# EAGLE design 00A-94 (EAGLE 6.3)
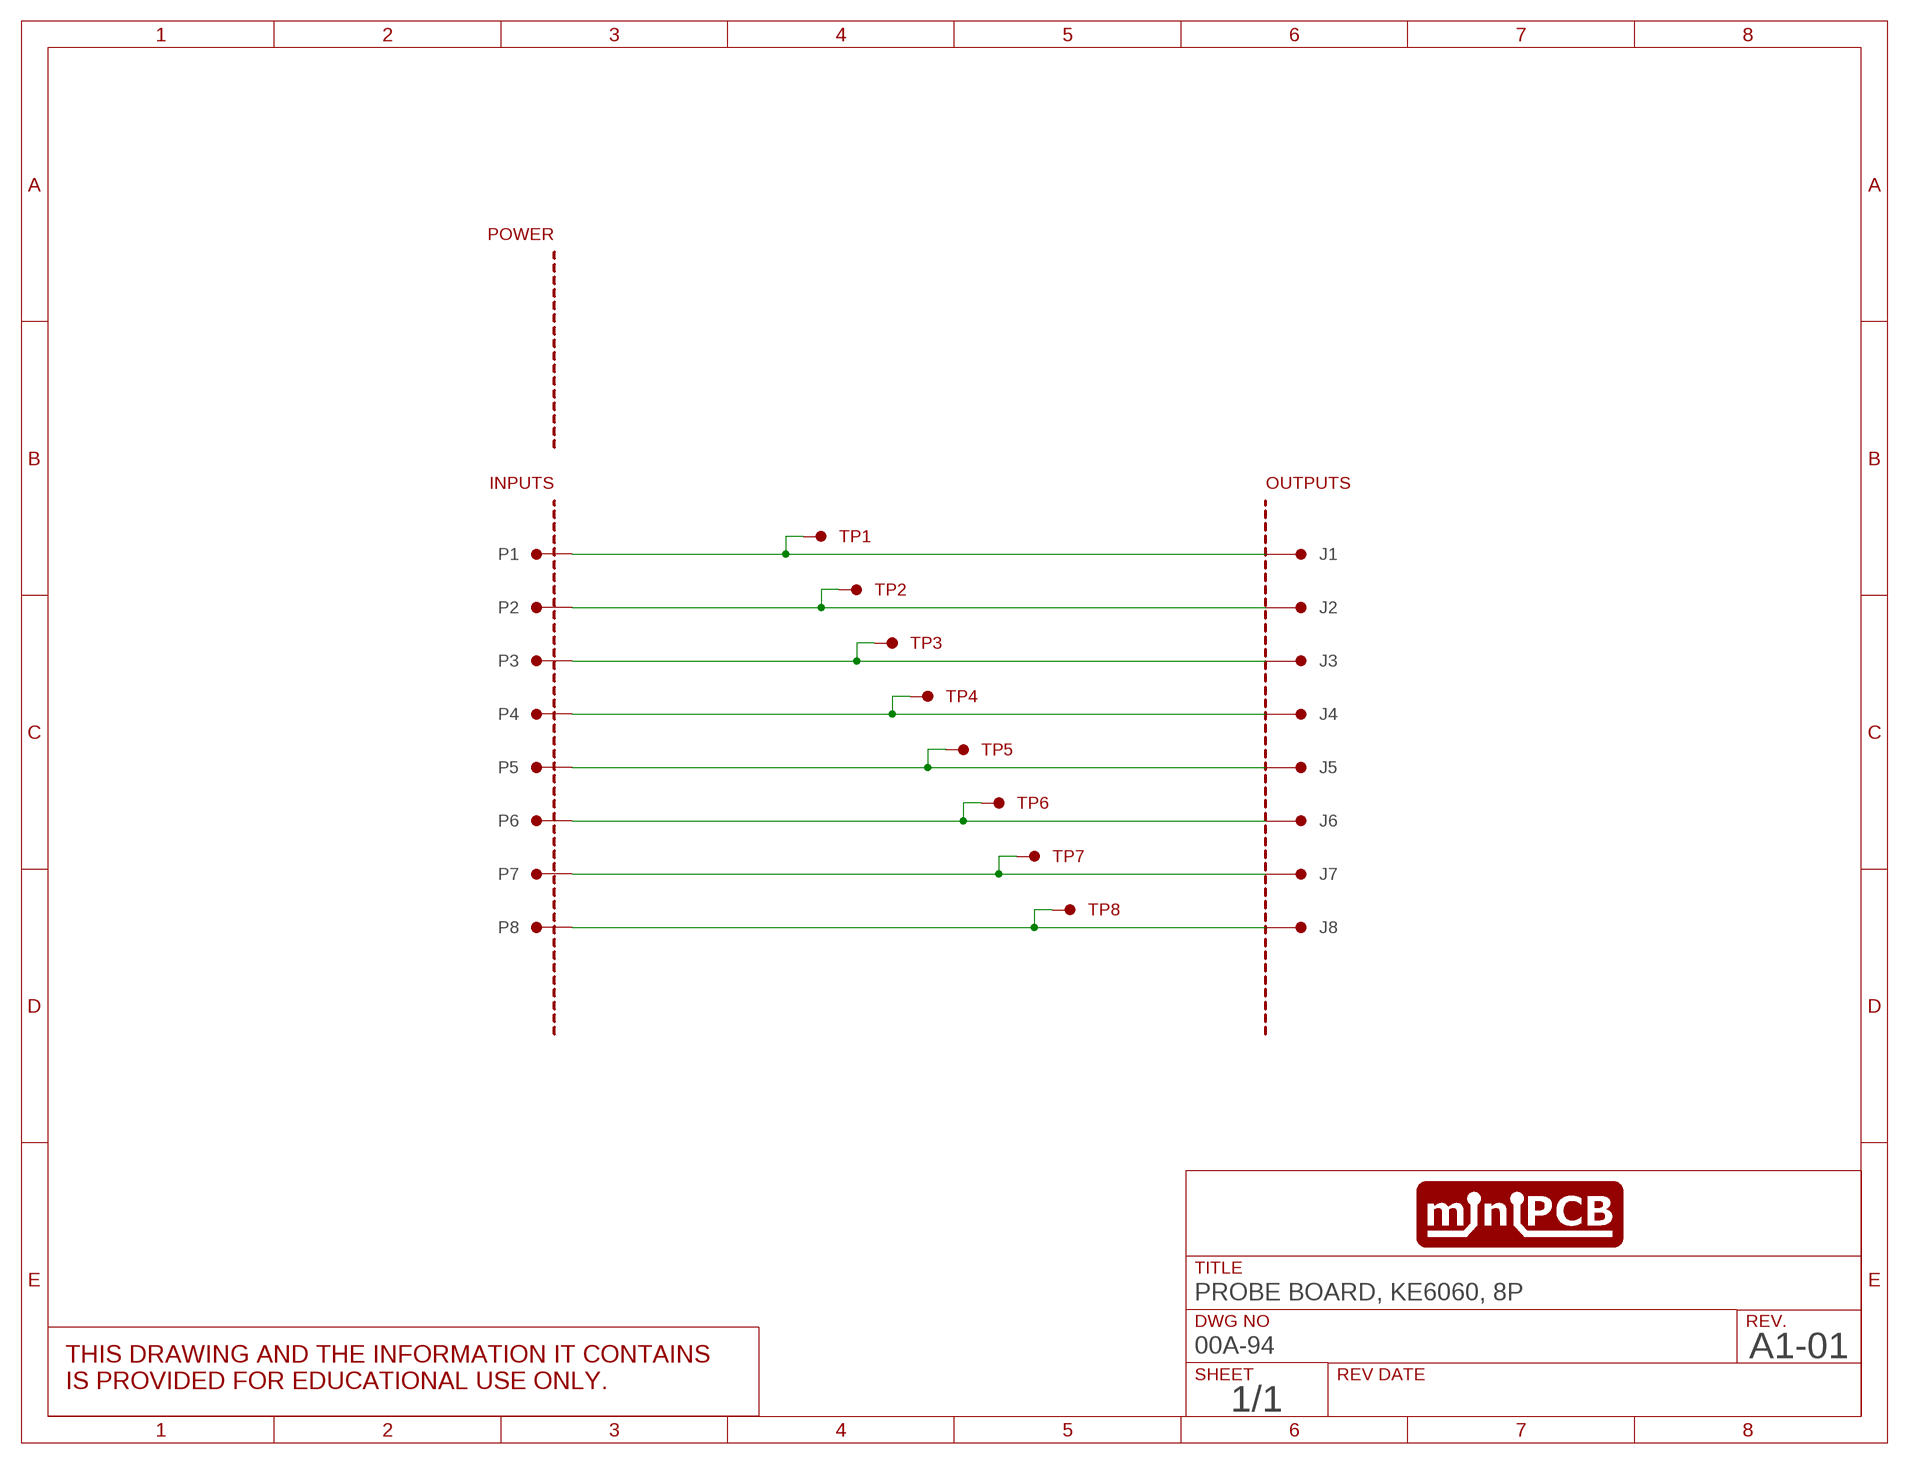
[diagram p0: schematic, sheet 1]
SHEET1 (SCHEMATIC): DWG_NO: 00A-94; REV: A1-01; TITLE: PROBE BOARD, KE6060, 8P

## Parts
J1  PINS_1KE6060  [PINS_1_KE6060]
J2  PINS_1KE6060  [PINS_1_KE6060]
J3  PINS_1KE6060  [PINS_1_KE6060]
J4  PINS_1KE6060  [PINS_1_KE6060]
J5  PINS_1KE6060  [PINS_1_KE6060]
J6  PINS_1KE6060  [PINS_1_KE6060]
J7  PINS_1KE6060  [PINS_1_KE6060]
J8  PINS_1KE6060  [PINS_1_KE6060]
P1  PINS_124AWG-NOTEXT  [PINS_1_1MM-NOTEXT]
P2  PINS_124AWG-NOTEXT  [PINS_1_1MM-NOTEXT]
P3  PINS_124AWG-NOTEXT  [PINS_1_1MM-NOTEXT]
P4  PINS_124AWG-NOTEXT  [PINS_1_1MM-NOTEXT]
P5  PINS_124AWG-NOTEXT  [PINS_1_1MM-NOTEXT]
P6  PINS_124AWG-NOTEXT  [PINS_1_1MM-NOTEXT]
P7  PINS_124AWG-NOTEXT  [PINS_1_1MM-NOTEXT]
P8  PINS_124AWG-NOTEXT  [PINS_1_1MM-NOTEXT]
PCB1  MINIPCB_0P00A-20X100  [MINIPCB_00A_20X100]
TP1  TESTPOINTKE5000-SMTEXT  [PINS_1_TESTPOINT_KE5000_NOTEXT]
TP2  TESTPOINTKE5000-SMTEXT  [PINS_1_TESTPOINT_KE5000_NOTEXT]
TP3  TESTPOINTKE5000-SMTEXT  [PINS_1_TESTPOINT_KE5000_NOTEXT]
TP4  TESTPOINTKE5000-SMTEXT  [PINS_1_TESTPOINT_KE5000_NOTEXT]
TP5  TESTPOINTKE5000-SMTEXT  [PINS_1_TESTPOINT_KE5000_NOTEXT]
TP6  TESTPOINTKE5000-SMTEXT  [PINS_1_TESTPOINT_KE5000_NOTEXT]
TP7  TESTPOINTKE5000-SMTEXT  [PINS_1_TESTPOINT_KE5000_NOTEXT]
TP8  TESTPOINTKE5000-SMTEXT  [PINS_1_TESTPOINT_KE5000_NOTEXT]

## Nets
N$1: J1.1 J1.2 P1.1 P1.2 TP1.1
N$2: J8.1 J8.2 P8.1 P8.2 TP8.1
N$3: J2.1 J2.2 P2.1 P2.2 TP2.1
N$5: J3.1 J3.2 P3.1 P3.2 TP3.1
N$7: J4.1 J4.2 P4.1 P4.2 TP4.1
N$9: J5.1 J5.2 P5.1 P5.2 TP5.1
N$11: J6.1 J6.2 P6.1 P6.2 TP6.1
N$14: J7.1 J7.2 P7.1 P7.2 TP7.1

## Library data of the parts
J1-J8 P1-P8 = minipcb:PINS_1
PCB1 = minipcb:MINIPCB_0P; PART_NUMBER: 00A-94-A1-01
TP1-TP8 = minipcb:TESTPOINT

## Board
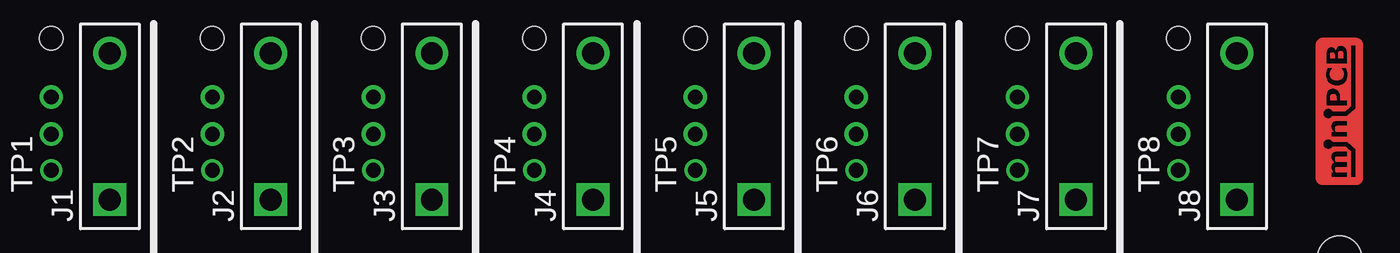
[diagram p1: board, top side]
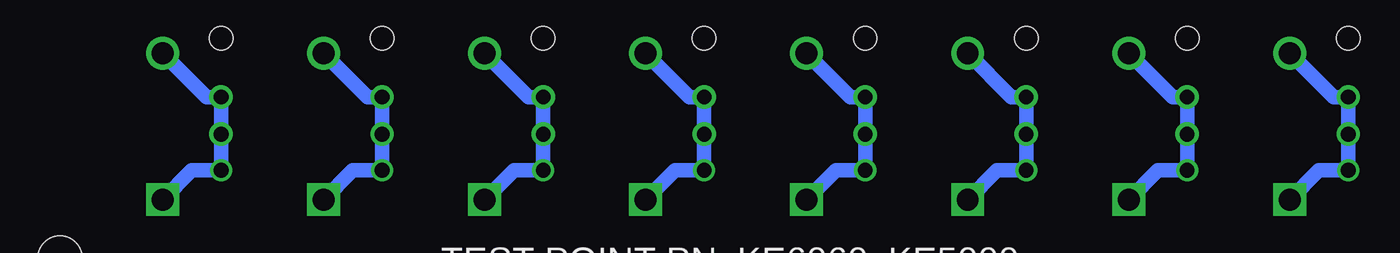
[diagram p2: board, bottom side, seen from below]

No outline drawn. Coordinates in mm, seen from the top.
Copper layers (1*16): Top 0.035mm / dielectric 1.5mm / Bottom 0.035mm
Design rules "default": minimum track width 10mil, minimum drill 0.6mm, track to track 8mil, track to pad 8mil, pad to pad 8mil, via to via 8mil, smd to smd 8mil, copper to edge 40mil, drill to drill 8mil, minimum pad ring 10mil, minimum via ring 8mil, stop-mask expansion 4mil, vias tented up to drill 0mil, thermal gap 10mil

### Footprints (pad centres in the part's own frame; a part is rotated, then mirrored left to right if it is on the bottom)
PINS_1_KE6060 = drill 1.5 square: 1 -5,0 | drill 1.5: 2 5,0
PINS_1_1MM-NOTEXT = drill 1 pad 1.6: 1 4,0; 2 6.54,0 | hole 1.6: 0,0
MINIPCB_00A_20X100 = hole 3: 97,3; 3,3
PINS_1_TESTPOINT_KE5000_NOTEXT = drill 1: 1 0,0

### Placement (x,y rotation side)
J1  13,12 90 top
J2  24,12 90 top
J3  35,12 90 top
J4  46,12 90 top
J5  57,12 90 top
J6  68,12 90 top
J7  79,12 90 top
J8  90,12 90 top
P1  9,18 270 top
P2  20,18 270 top
P3  31,18 270 top
P4  42,18 270 top
P5  53,18 270 top
P6  64,18 270 top
P7  75,18 270 top
P8  86,18 270 top
PCB1  0,0 0 top
TP1  9,9 90 top
TP2  20,9 90 top
TP3  31,9 90 top
TP4  42,9 90 top
TP5  53,9 90 top
TP6  64,9 90 top
TP7  75,9 90 top
TP8  86,9 90 top

### Tracks (layer width: path | path; a pad name or v marks a point on that pad's centre or on a via)
N$1
  Bottom 1: J1.2 10,14 P1.1 P1.2 TP1.1 11,9 J1.1
N$2
  Bottom 1: J8.2 87,14 P8.1 P8.2 TP8.1 88,9 J8.1
N$3
  Bottom 1: J2.2 21,14 P2.1 P2.2 TP2.1 22,9 J2.1
N$5
  Bottom 1: J3.2 32,14 P3.1 P3.2 TP3.1 33,9 J3.1
N$7
  Bottom 1: J4.2 43,14 P4.1 P4.2 TP4.1 44,9 J4.1
N$9
  Bottom 1: J5.2 54,14 P5.1 P5.2 TP5.1 55,9 J5.1
N$11
  Bottom 1: J6.2 65,14 P6.1 P6.2 TP6.1 66,9 J6.1
N$14
  Bottom 1: J7.2 76,14 P7.1 P7.2 TP7.1 77,9 J7.1

### Text on the board
bPlace: TEST POINT PN: KE6060, KE5000
_tNames: TP1 | TP2 | TP3 | TP4 | TP5 | TP6 | TP7 | TP8 | J1 | J2 | J3 | J4 | J5 | J6 | J7 | J8